# EasyEDA schematic SCH_CardV2 copy_2025-09-15_BACKUP.json
TITLE: Sheet_1; REV: 1.0; Date: 2023-11-30; Sheet: 1/1; Drawn By: schelleli; Company: Tesca Group
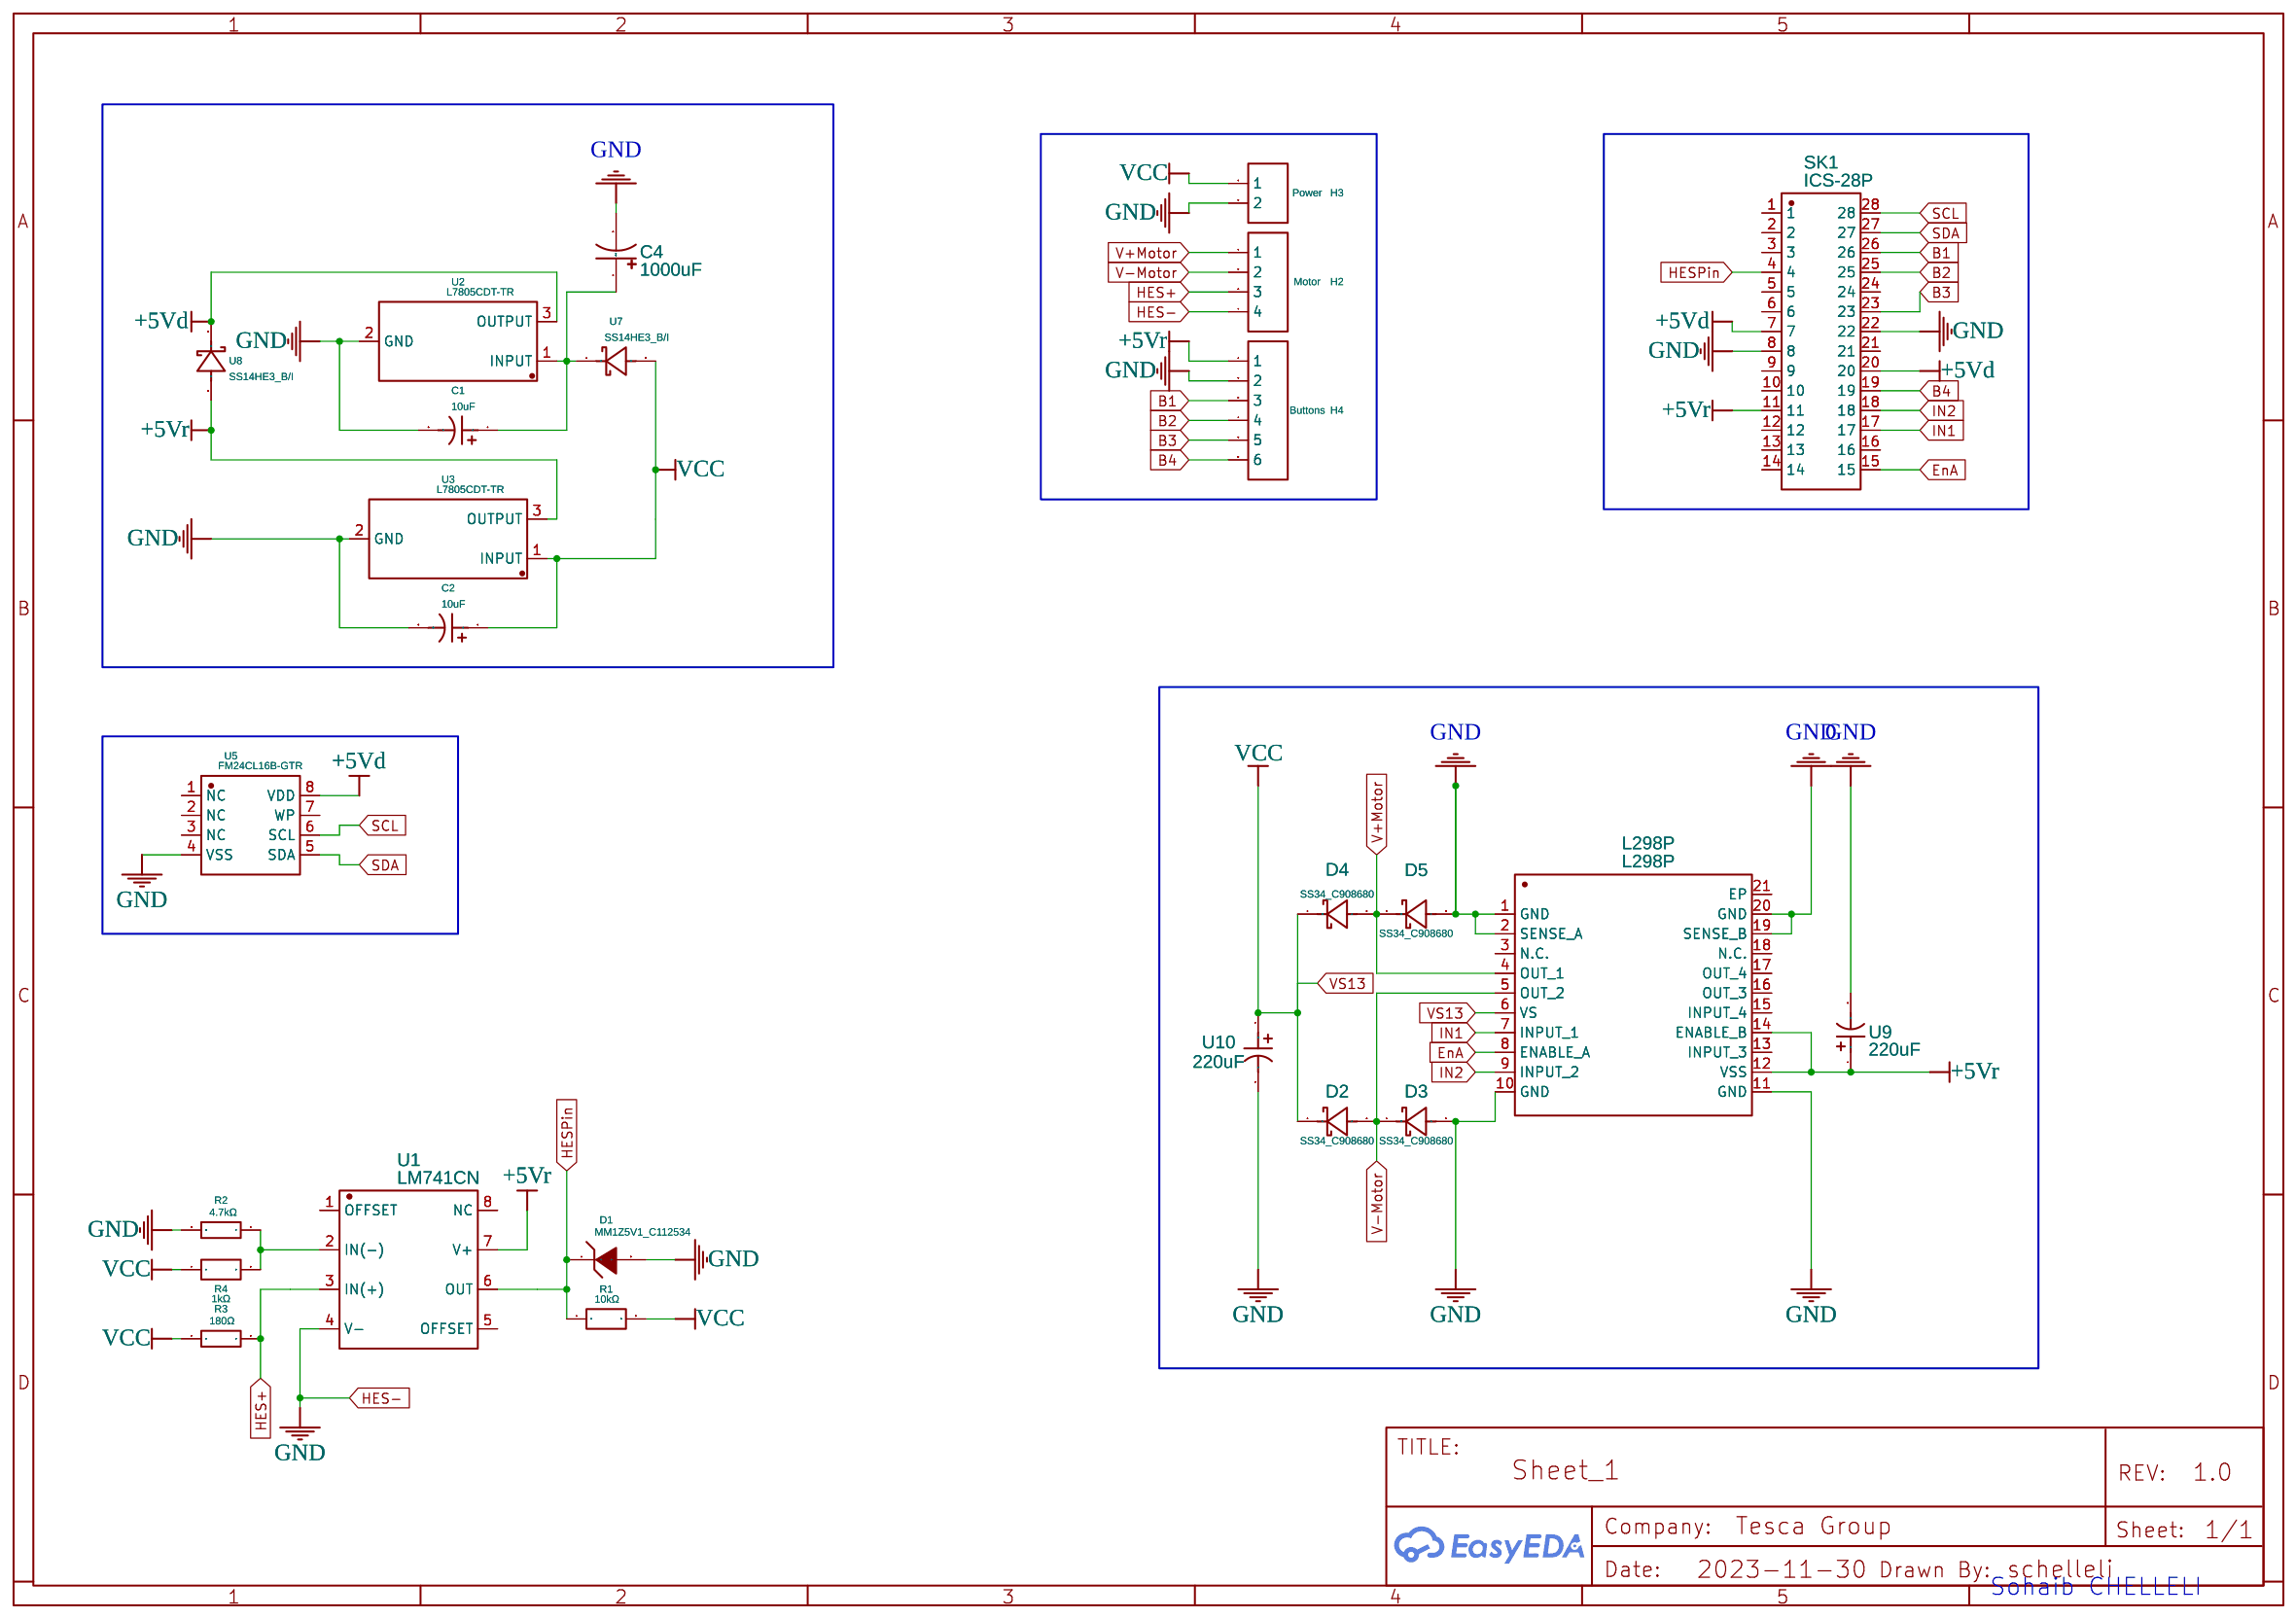
[diagram p0: schematic sheet]

## Parts
C1  10uF  [CAP-SMD_BD5.0-L5.3-W5.3-FD]
C2  10uF  [CAP-SMD_BD5.0-L5.3-W5.3-FD]
C4  1000uF  [CAP-SMD_BD10.0-L10.3-W10.3-FD]
D1  MM1Z5V1_C112534  [SOD-123_L2.8-W1.8-LS3.7-RD]
D2  SS34_C908680  [SMA_L4.3-W2.7-LS5.1-RD]
D3  SS34_C908680  [SMA_L4.3-W2.7-LS5.1-RD]
D4  SS34_C908680  [SMA_L4.3-W2.7-LS5.1-RD]
D5  SS34_C908680  [SMA_L4.3-W2.7-LS5.1-RD]
H2  Motor  [HDR-M-2.54_1X4]
H3  Power  [HDR-M-2.54_1X2]
H4  Buttons  [HDR-M-2.54_1X6]
L298P  L298P  [POWERSO20_L15.9-W11.0-P1.27-LS14.2-BL-EP]
R1  10kΩ  [R1206]
R2  4.7kΩ  [R1206]
R3  180Ω  [R2512]
R4  1kΩ  [R2010]
SK1  ICS-28P  [DIP-28_L16.8-W10.1-P2.54-LS7.62-BL]
U1  LM741CN  [DIP-8_L9.8-W6.6-P2.54-LS7.6-BL]
U2  L7805CDT-TR  [TO-252-3_L6.5-W5.8-P4.58-BL]
U3  L7805CDT-TR  [TO-252-3_L6.5-W5.8-P4.58-BL]
U5  FM24CL16B-GTR  [SOIC-8_L4.9-W3.9-P1.27-LS6.0-BL]
U7  SS14HE3_B/I  [SMA_L4.3-W2.7-LS5.1-RD]
U8  SS14HE3_B/I  [SMA_L4.3-W2.7-LS5.1-RD]
U9  220uF  [CAP-SMD_BD6.3-L6.6-W6.6-LS7.2-FD]
U10  220uF  [CAP-SMD_BD6.3-L6.6-W6.6-LS7.2-FD]

## Library data of the parts
C1 C2 = RVT10UF25V67RV0020: Contributor: lcsc; Supplier: LCSC; Supplier Part: C2992591; Manufacturer: KNSCHA(科尼盛); JLCPCB Part Class: Extended Part; link: https://lcsc.com/eda_search?q=C2992591&%26type=1&ref=editor
C4 = EEEFT1E102UP: Contributor: LCSC; Supplier: LCSC; Supplier Part: C401766; Manufacturer: PANASONIC(松下); JLCPCB Part Class: Extended Part; link: https://lcsc.com/eda_search?q=C401766&%26type=1&ref=editor
D1 = MM1Z5V1_C112534: Supplier: LCSC; Manufacturer: 晶导微电子; Manufacturer Part: MM1Z5V1; Supplier Part: C112534; JLCPCB Part Class: Extended Part; link: https://lcsc.com/eda_search?q=C112534&%26type=1&ref=editor
D2-D5 = SS34_C908680: Contributor: LCSC; Supplier: LCSC; Supplier Part: C908680; Manufacturer: GOODWORK(固得沃克); Manufacturer Part: SS34; JLCPCB Part Class: Extended Part; link: https://lcsc.com/eda_search?q=C908680&%26type=1&ref=editor
H2 = HDR-M-2.54_1x4: Supplier Part: C124378; Supplier: LCSC; Contributor: LCEDA_Lib
H3 = HDR-M-2.54_1x2: Supplier Part: C124375; Supplier: LCSC; Contributor: LCEDA_Lib
H4 = HDR-M-2.54_1x6: Supplier Part: C190819; Supplier: LCSC; Contributor: LCEDA_Lib
L298P = L298P: Supplier Part: C85595; Supplier: LCSC; Manufacturer: ST(意法半导体); JLCPCB Part Class: Extended Part; link: https://lcsc.com/eda_search?q=C85595&%26type=1&ref=editor
R1 = ARG06FTC1002: Contributor: LCSC; Supplier: LCSC; Supplier Part: C294118; Manufacturer: Viking(光颉); JLCPCB Part Class: Extended Part; link: https://lcsc.com/eda_search?q=C294118&%26type=1&ref=editor
R2 = RC1206FR-074K7L: Supplier: LCSC; Manufacturer: YAGEO(国巨); Supplier Part: C137262; JLCPCB Part Class: Extended Part; link: https://lcsc.com/eda_search?q=C137262&%26type=1&ref=editor
R3 = CR2512F180RE042W: Contributor: LCSC; Supplier: LCSC; Supplier Part: C175292; Manufacturer: EVER OHMS(天二科技); Manufacturer Part: CRH2512F180RE04Z; JLCPCB Part Class: Extended Part; link: https://lcsc.com/eda_search?q=C175292&%26type=1&ref=editor
R4 = RS-10K1001FT: Contributor: LCSC; Supplier: LCSC; Supplier Part: C880311; Manufacturer: FH(风华); JLCPCB Part Class: Extended Part; link: https://lcsc.com/eda_search?q=C880311&%26type=1&ref=editor
SK1 = ICS-28P: Contributor: LCSC; Supplier: LCSC; Supplier Part: C146582; Manufacturer: Ckmtw(灿科盟); Manufacturer Part: Z-ICS0S28P-NG00; JLCPCB Part Class: Extended Part; link: https://lcsc.com/eda_search?q=C146582&%26type=1&ref=editor
U1 = LM741CN: sourceId: DPJ1jBuM4; Supplier: LCSC; Manufacturer: TI(德州仪器); Manufacturer Part: LM741CN/NOPB; Supplier Part: C13974; JLCPCB Part Class: Extended Part; link: https://lcsc.com/eda_search?q=C13974&%26type=1&ref=editor
U2 U3 = L7805CDT-TR: Contributor: LCSC; Supplier: LCSC; Supplier Part: C310413; Manufacturer: ST(意法半导体); JLCPCB Part Class: Extended Part; link: https://lcsc.com/eda_search?q=C310413&%26type=1&ref=editor
U5 = FM24CL16B-GTR: Supplier: LCSC; Manufacturer: CYPRESS(赛普拉斯); Supplier Part: C31082; JLCPCB Part Class: Extended Part; link: https://lcsc.com/eda_search?q=C31082&%26type=1&ref=editor
U7 U8 = SS14HE3_B/I: Contributor: lcsc; Supplier: LCSC; Supplier Part: C467991; Manufacturer: VISHAY(威世); JLCPCB Part Class: Extended Part; link: https://lcsc.com/eda_search?q=C467991&%26type=1&ref=editor
U9 U10 = RST220UF25V019: Contributor: lcsc; Supplier: LCSC; Supplier Part: C4747974; Manufacturer: KNSCHA(科尼盛); JLCPCB Part Class: Extended Part; link: https://lcsc.com/eda_search?q=C4747974&%26type=1&ref=editor

## Nets
+5Vd: SK1.7 SK1.20 U2.3(OUTPUT) U5.8(VDD) U8.1(K)
+5Vr: H4.1 L298P.12(VSS) L298P.14(ENABLE B) SK1.11 U1.7(V+) U3.3(OUTPUT) U8.2(A) U9.1
GND: C1.2 C2.2 C4.2 D1.2(A) D3.2(A) D5.2(A) H2.4 H3.2 H4.2 L298P.1(GND) L298P.2(SENSE A) L298P.10(GND) L298P.11(GND) L298P.19(SENSE B) L298P.20(GND) R2.2 SK1.8 SK1.22 U1.4(V-) U2.2(GND) U3.2(GND) U5.4(VSS) U9.2 U10.2
VCC: C2.1 D2.1(C) D4.1(C) H3.1 L298P.6(VS) R1.2 R3.1 R4.1 U3.1(INPUT) U7.2(A) U10.1
B1: H4.3 SK1.26
B2: H4.4 SK1.25
B3: H4.5 SK1.23
B4: H4.6 SK1.19
EnA: L298P.8(ENABLE A) SK1.15
HES+: H2.3 R3.2 U1.3(IN(+))
HESPin: D1.1(K) R1.1 SK1.4 U1.6(OUT)
IN1: L298P.7(INPUT 1) SK1.17
IN2: L298P.9(INPUT 2) SK1.18
SCL: SK1.28 U5.6(SCL)
SDA: SK1.27 U5.5(SDA)
V+Motor: D4.2(A) D5.1(C) H2.1 L298P.4(OUT 1)
V-Motor: D2.2(A) D3.1(C) H2.2 L298P.5(OUT 2)
Net-(C1-1): C1.1 C4.1 U2.1(INPUT) U7.1(K)
Net-(R2-1): R2.1 R4.2 U1.2(IN(-))

Not connected (* = marked no-connect by the designer): L298P 3(N.C.) 13(INPUT 3) 15(INPUT 4) 16(OUT 3) 17(OUT 4) 18(N.C.) 21(EP); SK1 1 2 3 5 6 9 10 12 13 14 16 21 24; U1 1(OFFSET) 5(OFFSET) 8(NC); U5 1(NC) 2(NC) 3(NC) 7(WP)

## Notes on the sheet
- Sohaib CHELLELI
